# Altium schematic sheet Microphone.SchDoc
size A
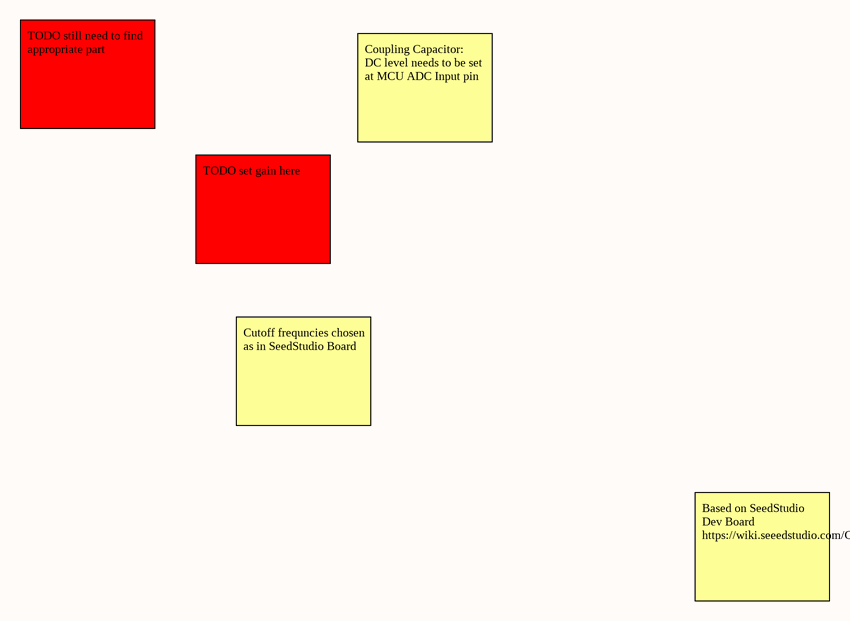
[diagram p0: Microphone.SchDoc]

## Notes on the sheet
- TODO still need to find appropriate part
- Coupling Capacitor:
  DC level needs to be set at MCU ADC Input pin
- TODO set gain here
- Cutoff frequncies chosen as in SeedStudio Board
- Based on SeedStudio Dev Board https://wiki.seeedstudio.com/Grove-Analog-Microphone/